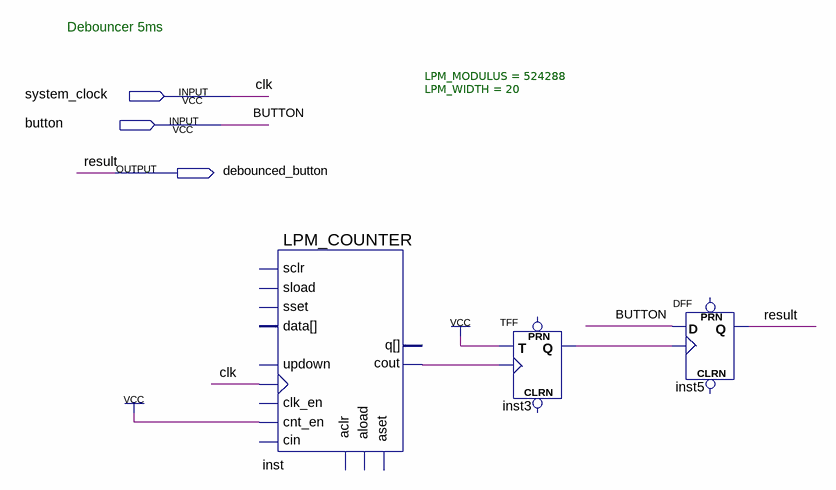
[diagram p0: schematic sheet]
// Quartus schematic debounce2.bdf as structural Verilog: 3 symbols, 3 pins
module debounce2 (
  input  system_clock,
  input  button,
  output debounced_button
);

  wire inst3_q, inst_cout;

  LPM_COUNTER #(.LPM_MODULUS(524288), .LPM_WIDTH(20)) inst (
    .clock(system_clock), .cnt_en(1'b1), .cout(inst_cout));  // open: sload, data, clk_en, aload, aclr, aset, cin, sset, updown, sclr, q
  TFF inst3 (.T(1'b1), .CLK(inst_cout), .Q(inst3_q));  // open: PRN, CLRN
  DFF inst5 (.CLK(inst3_q), .D(button), .Q(debounced_button));  // open: CLRN, PRN

  // Other names for the same wires on the sheet: clk = system_clock; result = debounced_button

  // Notes on the sheet:
  //   Debouncer 5ms
endmodule
